# EAGLE schematic Trigger Board (EAGLE 7.5.0)
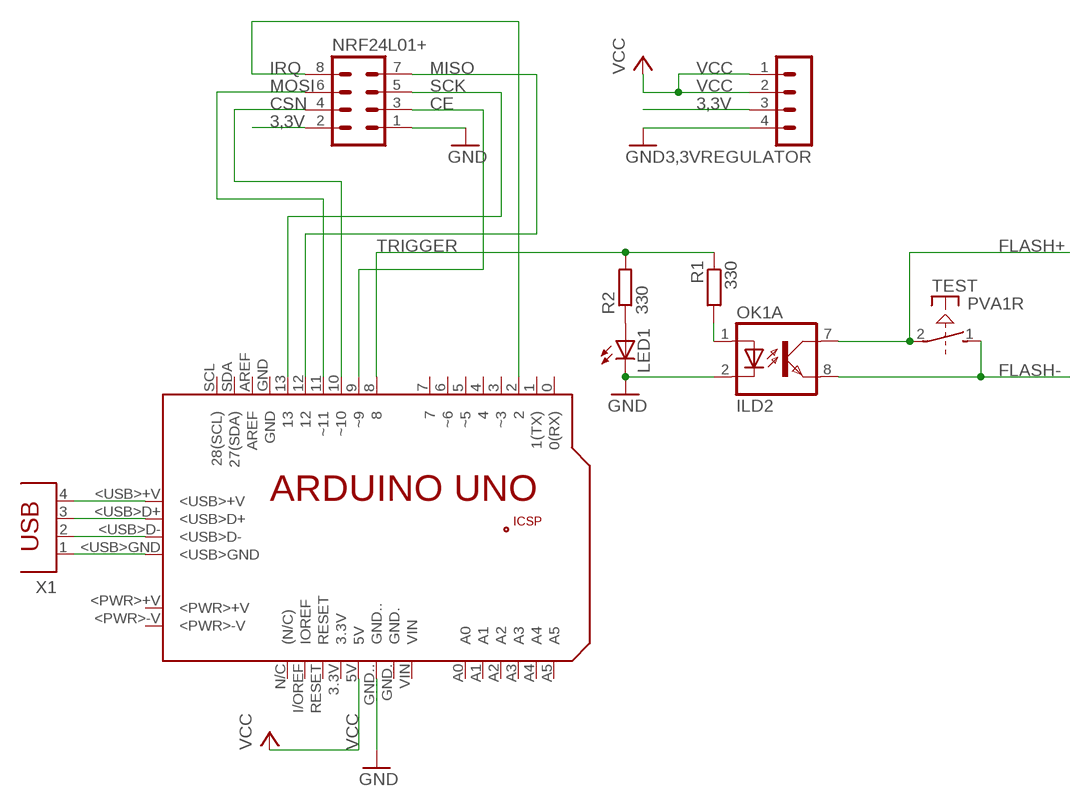
[diagram p0: schematic, sheet 1]

## Parts
3,3VREGULATOR  MA04-1  [MA04-1]
LED1  LED3MM  [LED3MM]
NRF24L01+  MA04-2  [MA04-2]
OK1  ILD2  [DIL08]
PCB1  ARDUINO_UNO  [ARDUINO_UNO]
R1  330  R-EU_0207/10  [0207/10]
R2  330  R-EU_0207/10  [0207/10]
TEST  PVA1R  [PVA1R]
X1  PN61729  [PN61729]

## Nets
3,3V: 3,3VREGULATOR.3 NRF24L01+.2
CE: NRF24L01+.3 PCB1.9(~9)
CSN: NRF24L01+.4 PCB1.10(~10)
FLASH+: OK1.7(A:COL) TEST.2(1:P)
FLASH-: OK1.8(A:EMIT) TEST.1(1:S)
GND: 3,3VREGULATOR.4 LED1.K(C) NRF24L01+.1 OK1.2(A:C) PCB1.GND..
IRQ: NRF24L01+.8 PCB1.2
MISO: NRF24L01+.7 PCB1.12
MOSI: NRF24L01+.6 PCB1.11(~11)
N$1: OK1.1(A:A) R1.2
N$2: LED1.A R2.1
N$4: PCB1.<USB>+V X1.4
N$5: PCB1.<USB>D+ X1.3
N$6: PCB1.<USB>D- X1.2
N$7: PCB1.<USB>GND X1.1
SCK: NRF24L01+.5 PCB1.13
TRIGGER: PCB1.8 R1.1 R2.2
VCC: 3,3VREGULATOR.1 3,3VREGULATOR.2 PCB1.5V
Unconnected: OK1.3(B:C) OK1.4(B:A) OK1.5(B:EMIT) OK1.6(B:COL) PCB1.0(0(RX)) PCB1.1(1(TX)) PCB1.3(~3) PCB1.3.3V PCB1.4 PCB1.5(~5) PCB1.6(~6) PCB1.7 PCB1.+5V PCB1.<PWR>+V PCB1.<PWR>-V PCB1.A0 PCB1.A1 PCB1.A2 PCB1.A3 PCB1.A4 PCB1.A5 PCB1.AREF PCB1.GND PCB1.GND. PCB1.GND_ PCB1.I/OREF(IOREF) PCB1.MISO PCB1.MOSI PCB1.N/C((N/C)) PCB1.RESET PCB1.RESET. PCB1.SCK PCB1.SCL(28(SCL)) PCB1.SDA(27(SDA)) PCB1.VIN TEST.3(2:S) TEST.4(2:P)

## Library data of the parts
3,3VREGULATOR = con-lstb:MA04-1: PIN HEADER; OC_FARNELL: unknown; OC_NEWARK: unknown
LED1 = led:LED: LED OSRAM: - CHIPLED LG R971, LG N971, LY N971, LG Q971, LY Q971, LO R971, LY R971 LH N974, LH R974 LS Q976, LO Q976, LY Q976 LO Q996 - Hyper CHIPLED LW Q18S LB Q993, LB Q99A, LB R99A - SideLED LS A670, LO A670, LY A670, LG A670, LP A670 LB A673, LV A673, LT A673, LW A673 LH A674 LY A675 LS A676, LA A676, LO A676, LY A676, LW A676 LS A679, LY A679, LG A679 - Hyper Micro SIDELED® LS Y876, LA Y876, LO Y876, LY Y876 LT Y87S - SmartLED LW L88C, LW L88S LB L89C, LB L89S, LG L890 LS L89K, LO L89K, LY L89K LS L896, LA L896, LO L896, LY L896 - TOPLED LS T670, LO T670, LY T670, LG T670, LP T670 LSG T670, LSP T670, LSY T670, LOP T670, LYG T670 LG T671, LOG T671, LSG T671 LB T673, LV T673, LT T673, LW T673 LH T674 LS T676, LA T676, LO T676, LY T676, LB T676, LH T676, LSB T676, LW T676 LB T67C, LV T67C, LT T67C, LS T67K, LO T67K, LY T67K, LW E67C LS E67B, LA E67B, LO E67B, LY E67B, LB E67C, LV E67C, LT E67C LW T67C LS T679, LY T679, LG T679 LS T770, LO T770, LY T770, LG T770, LP T770 LB T773, LV T773, LT T773, LW T773 LH T774 LS E675, LA E675, LY E675, LS T675 LS T776, LA T776, LO T776, LY T776, LB T776 LHGB T686 LT T68C, LB T68C - Hyper Mini TOPLED® LB M676 - Mini TOPLED Santana® LG M470 LS M47K, LO M47K, LY M47K Source: http://www.osram.convergy.de LUXEON: - LUMILED® LXK2-PW12-R00, LXK2-PW12-S00, LXK2-PW14-U00, LXK2-PW14-V00 LXK2-PM12-R00, LXK2-PM12-S00, LXK2-PM14-U00 LXK2-PE12-Q00, LXK2-PE12-R00, LXK2-PE12-S00, LXK2-PE14-T00, LXK2-PE14-U00 LXK2-PB12-K00, LXK2-PB12-L00, LXK2-PB12-M00, LXK2-PB14-N00, LXK2-PB14-P00, LXK2-PB14-Q00 LXK2-PR12-L00, LXK2-PR12-M00, LXK2-PR14-Q00, LXK2-PR14-R00 LXK2-PD12-Q00, LXK2-PD12-R00, LXK2-PD12-S00 LXK2-PH12-R00, LXK2-PH12-S00 LXK2-PL12-P00, LXK2-PL12-Q00, LXK2-PL12-R00 Source: www.luxeon.com KINGBRIGHT: KA-3528ASYC Source: www.kingbright.com
NRF24L01+ = con-lstb:MA04-2: PIN HEADER; OC_FARNELL: unknown; OC_NEWARK: unknown
OK1 = optocoupler:ILD2: SIEMENS OPTO COUPLER; OC_FARNELL: 1469596; OC_NEWARK: unknown
PCB1 = E14_Arduino_revB:ARDUINO_UNO: Device for representing an Arduino Uno board with a footprint in an EAGLE design. Created by Dave Young for Element14. More EAGLE documentation at: http://www.element14.com/community/community/knode/cadsoft_eagle
R1 R2 = resistor:R-EU_: RESISTOR, European symbol
TEST = switch-misc:PVA1R: ITT SWITCH
X1 = con-berg:PN61729: BERG USB connector; OC_FARNELL: unknown; OC_NEWARK: unknown